# EAGLE design Luminis_20210106 (EAGLE 9.3.2)
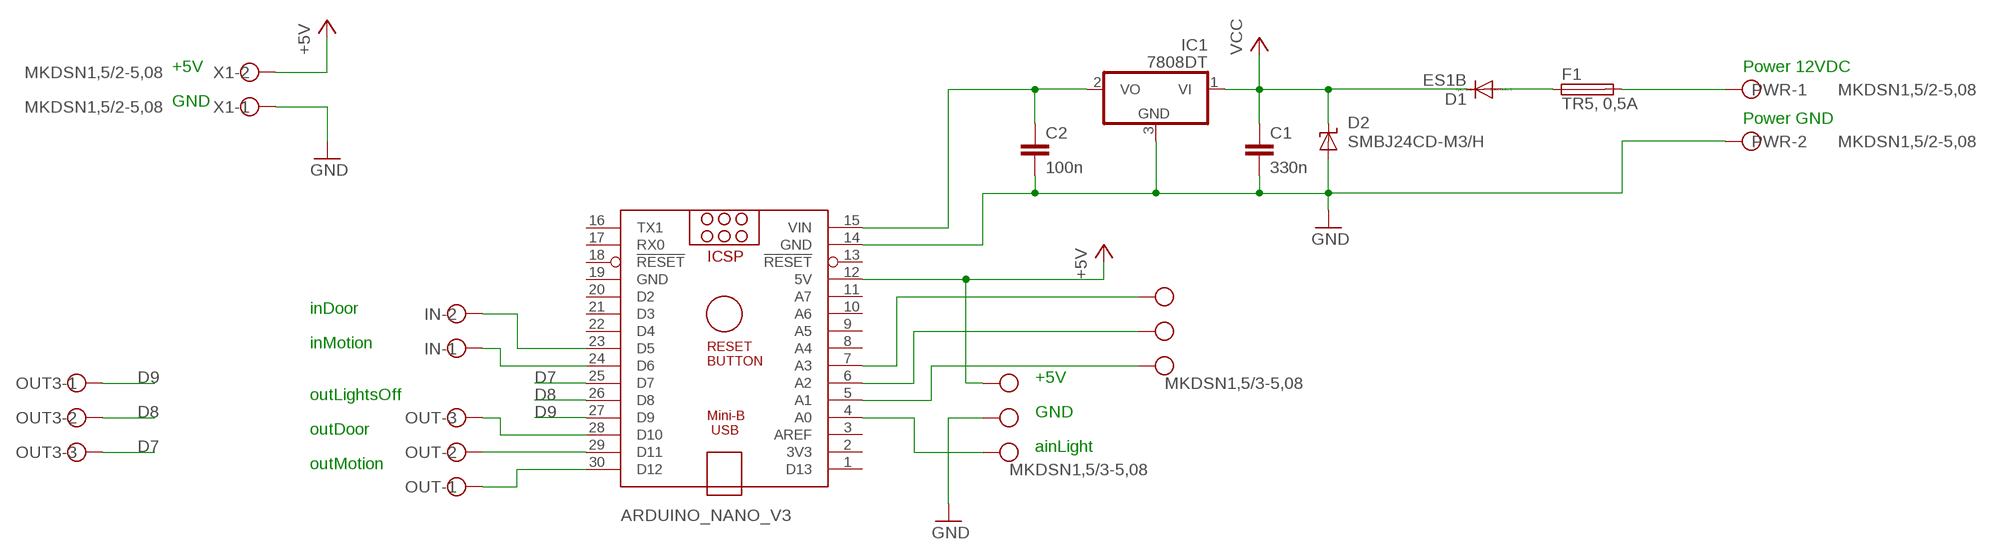
[diagram p0: schematic, sheet 1]

## Parts
ARDUINO_NANO_V3  ARDUINO_NANO  [ARDUINO_NANO]
C1  330n  C-EUC1206  [C1206]
C2  100n  C-EUC1206  [C1206]
D1  ES1B  DIODE-DO214AC  [DO214AC]
D2  SMBJ24CD-M3/H  SUPPRESSOR-SMBJ  [SMBJ]
F1  TR5, 0,5A  TR5  [TR5]
IC1  7808DT  [TO252]
IN  MKDSN1,5/2-5,08  [MKDSN1,5/2-5,08]
OUT  MKDSN1,5/3-5,08  [MKDSN1,5/3-5,08]
OUT1  MKDSN1,5/3-5,08  [MKDSN1,5/3-5,08]
OUT2  MKDSN1,5/3-5,08  [MKDSN1,5/3-5,08]
OUT3  MKDSN1,5/3-5,08  [MKDSN1,5/3-5,08]
PWR  MKDSN1,5/2-5,08  [MKDSN1,5/2-5,08]
X1  MKDSN1,5/2-5,08  [MKDSN1,5/2-5,08]

## Nets
+5V: ARDUINO_NANO_V3.12(5V) OUT1.1 X1.2
D7: ARDUINO_NANO_V3.25(D7) OUT3.3
D8: ARDUINO_NANO_V3.26(D8) OUT3.2
D9: ARDUINO_NANO_V3.27(D9) OUT3.1
GND: ARDUINO_NANO_V3.14(GND) C1.2 C2.2 D2.A IC1.3(GND) OUT1.2 PWR.2 X1.1
N$1: ARDUINO_NANO_V3.4(A0) OUT1.3
N$2: ARDUINO_NANO_V3.5(A1) OUT2.3
N$3: ARDUINO_NANO_V3.30(D12) OUT.1
N$4: ARDUINO_NANO_V3.6(A2) OUT2.2
N$5: F1.2 PWR.1
N$6: ARDUINO_NANO_V3.29(D11) OUT.2
N$7: ARDUINO_NANO_V3.28(D10) OUT.3
N$8: ARDUINO_NANO_V3.7(A3) OUT2.1
N$9: ARDUINO_NANO_V3.24(D6) IN.1
N$10: ARDUINO_NANO_V3.23(D5) IN.2
N$46: D1.A F1.1
N$48: ARDUINO_NANO_V3.15(VIN) C2.1 IC1.2(VO)
VCC: C1.1 D1.C D2.C IC1.1(VI)
Unconnected: ARDUINO_NANO_V3.1(D13) ARDUINO_NANO_V3.2(3V3) ARDUINO_NANO_V3.3(AREF) ARDUINO_NANO_V3.8(A4) ARDUINO_NANO_V3.9(A5) ARDUINO_NANO_V3.10(A6) ARDUINO_NANO_V3.11(A7) ARDUINO_NANO_V3.13(!RESET) ARDUINO_NANO_V3.16(TX1) ARDUINO_NANO_V3.17(RX0) ARDUINO_NANO_V3.18(!RESET) ARDUINO_NANO_V3.20(D2) ARDUINO_NANO_V3.21(D3) ARDUINO_NANO_V3.22(D4)

## Notes on the sheet
- +5V | Power 12VDC
- GND
- Power GND
- inDoor
- inMotion
- +5V
- outLightsOff
- GND
- outDoor
- ainLight
- outMotion

## Power pins joined to a net without a drawn wire
GND: ARDUINO_NANO_V3.19(GND)

## Library data of the parts
ARDUINO_NANO_V3 = ArduinoNanoV30:ARDUINO_NANO: Arduino Nano V3.0 Overview: The Arduino Nano is a small, complete, and breadboard-friendly board based on the ATmega328 (Arduino Nano 3.x) or ATmega168 (Arduino Nano 2.x). It has more or less the same functionality of the Arduino Duemilanove, but in a different package. It lacks only a DC power jack, and works with a Mini-B USB cable instead of a standard one. The Nano was designed and is being produced by Gravitech. Specifications: Microcontroller Atmel ATmega168 or ATmega328 Operating Voltage (logic level) 5 V Input Voltage (recommended) 7-12 V Input Voltage (limits) 6-20 V Digital I/O Pins 14 (of which 6 provide PWM output) Analog Input Pins 8 DC Current per I/O Pin 40 mA Flash Memory 16 KB (ATmega168) or 32 KB (ATmega328) of which 2 KB used by bootloader SRAM 1 KB (ATmega168) or 2 KB (ATmega328) EEPROM 512 bytes (ATmega168) or 1 KB (ATmega328) Clock Speed 16 MHz Dimensions 0.73" x 1.70" Length 45 mm Width 18 mm Weigth 5 g Power: The Arduino Nano can be powered via the Mini-B USB connection, 6-20V unregulated external power supply (pin 30), or 5V regulated external power supply (pin 27). The power source is automatically selected to the highest voltage source. Memory: The ATmega168 has 16 KB of flash memory for storing code (of which 2 KB is used for the bootloader); the ATmega328 has 32 KB, (also with 2 KB used for the bootloader). The ATmega168 has 1 KB of SRAM and 512 bytes of EEPROM (which can be read and written with the EEPROM library); the ATmega328 has 2 KB of SRAM and 1 KB of EEPROM. Input and Output: Each of the 14 digital pins on the Nano can be used as an input or output, using pinMode(), digitalWrite(), and digitalRead() functions. They operate at 5 volts. Each pin can provide or receive a maximum of 40 mA and has an internal pull-up resistor (disconnected by default) of 20-50 kOhms. In addition, some pins have specialized functions. Visit Arduino - ArduinoBoardNano <https://www.arduino.cc/en/Main/ArduinoBoardNano>
C1 C2 = rcl:C-EU: CAPACITOR, European symbol; SPICEPREFIX: C
D1 = diode:DIODE-: DIODE
D2 = diode:SUPPRESSOR-: Suppressor diode
F1 = fuse:TR5: FUSE Wickmann; OC_FARNELL: unknown; OC_NEWARK: unknown
IC1 = linear:78*: Positive VOLTAGE REGULATOR Source: http://cache.national.com/ds/LM/LM78L05.pdf http://www.fairchildsemi.com/ds/LM/LM7805.pdf
IN PWR X1 = con-phoenix-508:MKDSN1,5/2-5,08: MKDSN 1,5/ 2-5,08 Printklemme Nennstrom: 13,5 A Nennspannung: 250 V Rastermaß: 5,08 mm Polzahl: 2 Anschlussart: Schraubanschluss Montage: Löten Anschlussrichtung Leiter/Platine: 0 ° Artikelnummer: 1729128 Source: http://eshop.phoenixcontact.com .. 1729128.pdf
OUT OUT1-OUT3 = con-phoenix-508:MKDSN1,5/3-5,08: MKDSN 1,5/ 3-5,08 Printklemme Nennstrom: 13,5 A Nennspannung: 250 V Rastermaß: 5,08 mm Polzahl: 3 Anschlussart: Schraubanschluss Montage: Löten Anschlussrichtung Leiter/Platine: 0 ° Artikelnummer: 1729131 Source: http://eshop.phoenixcontact.com .. 1729131.pdf

## Board
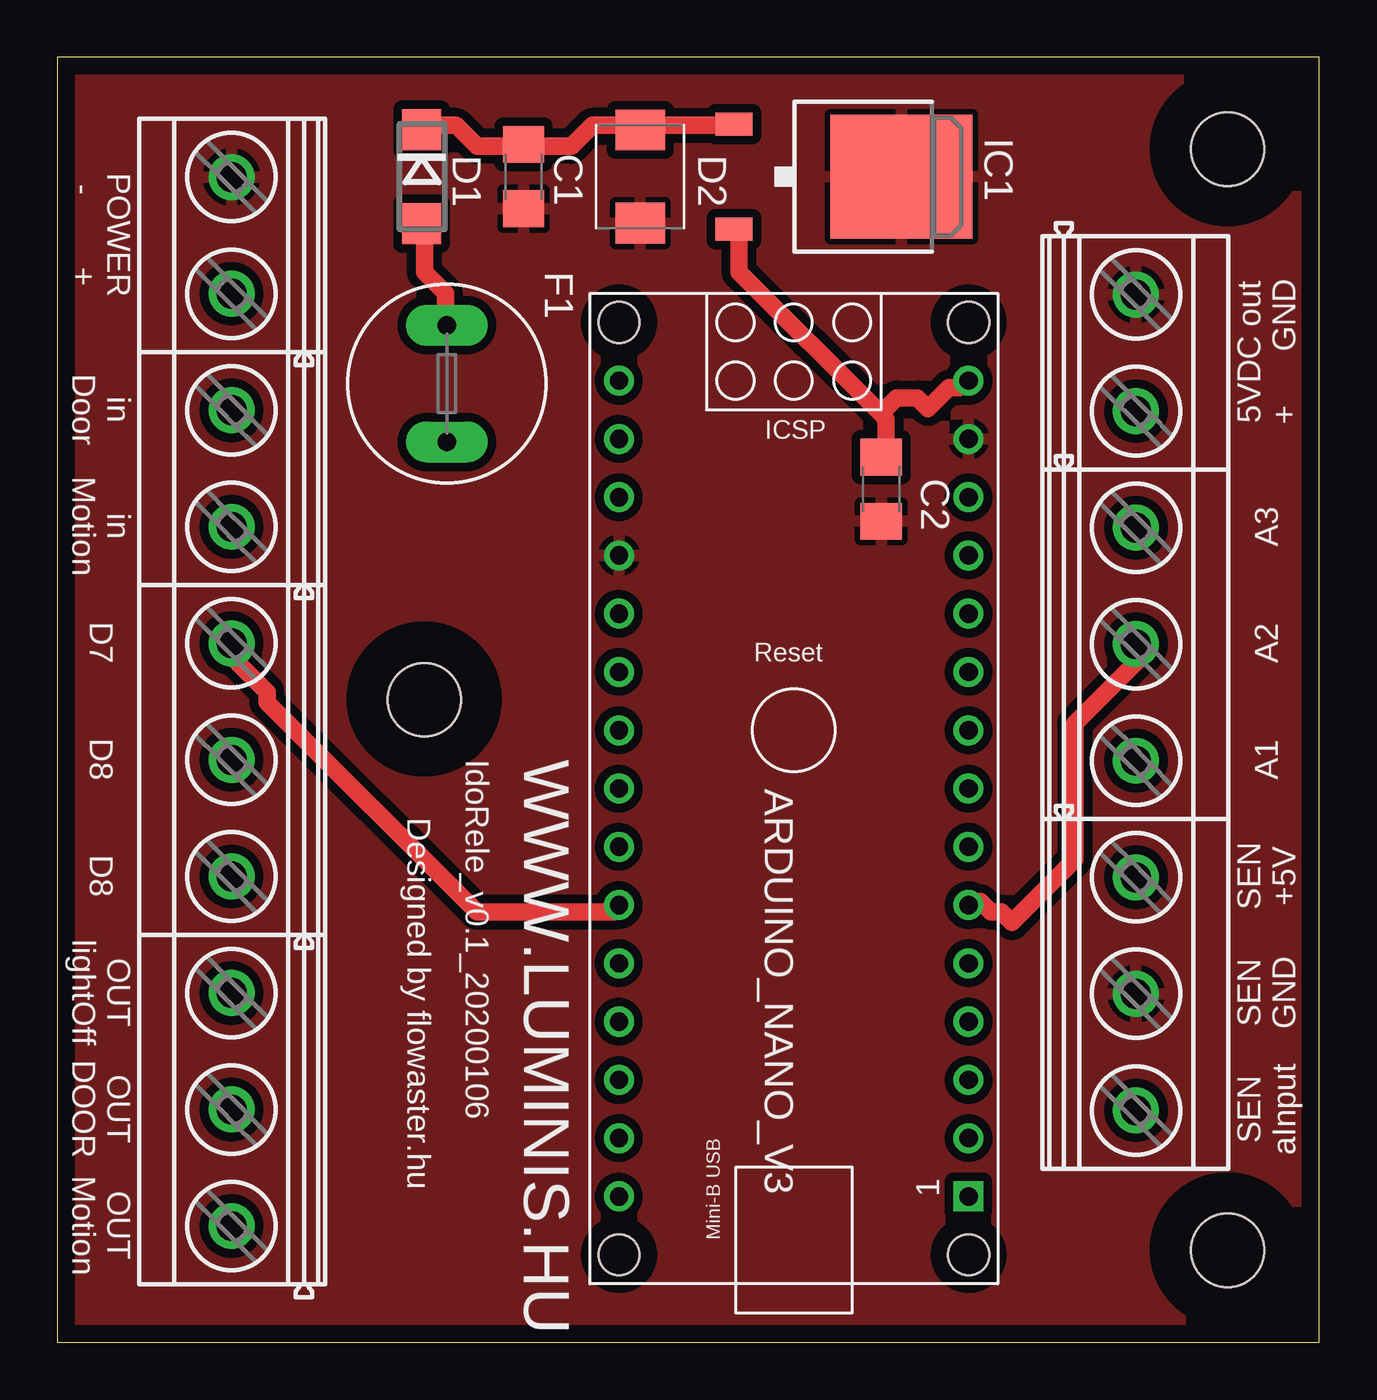
[diagram p1: board, top side]
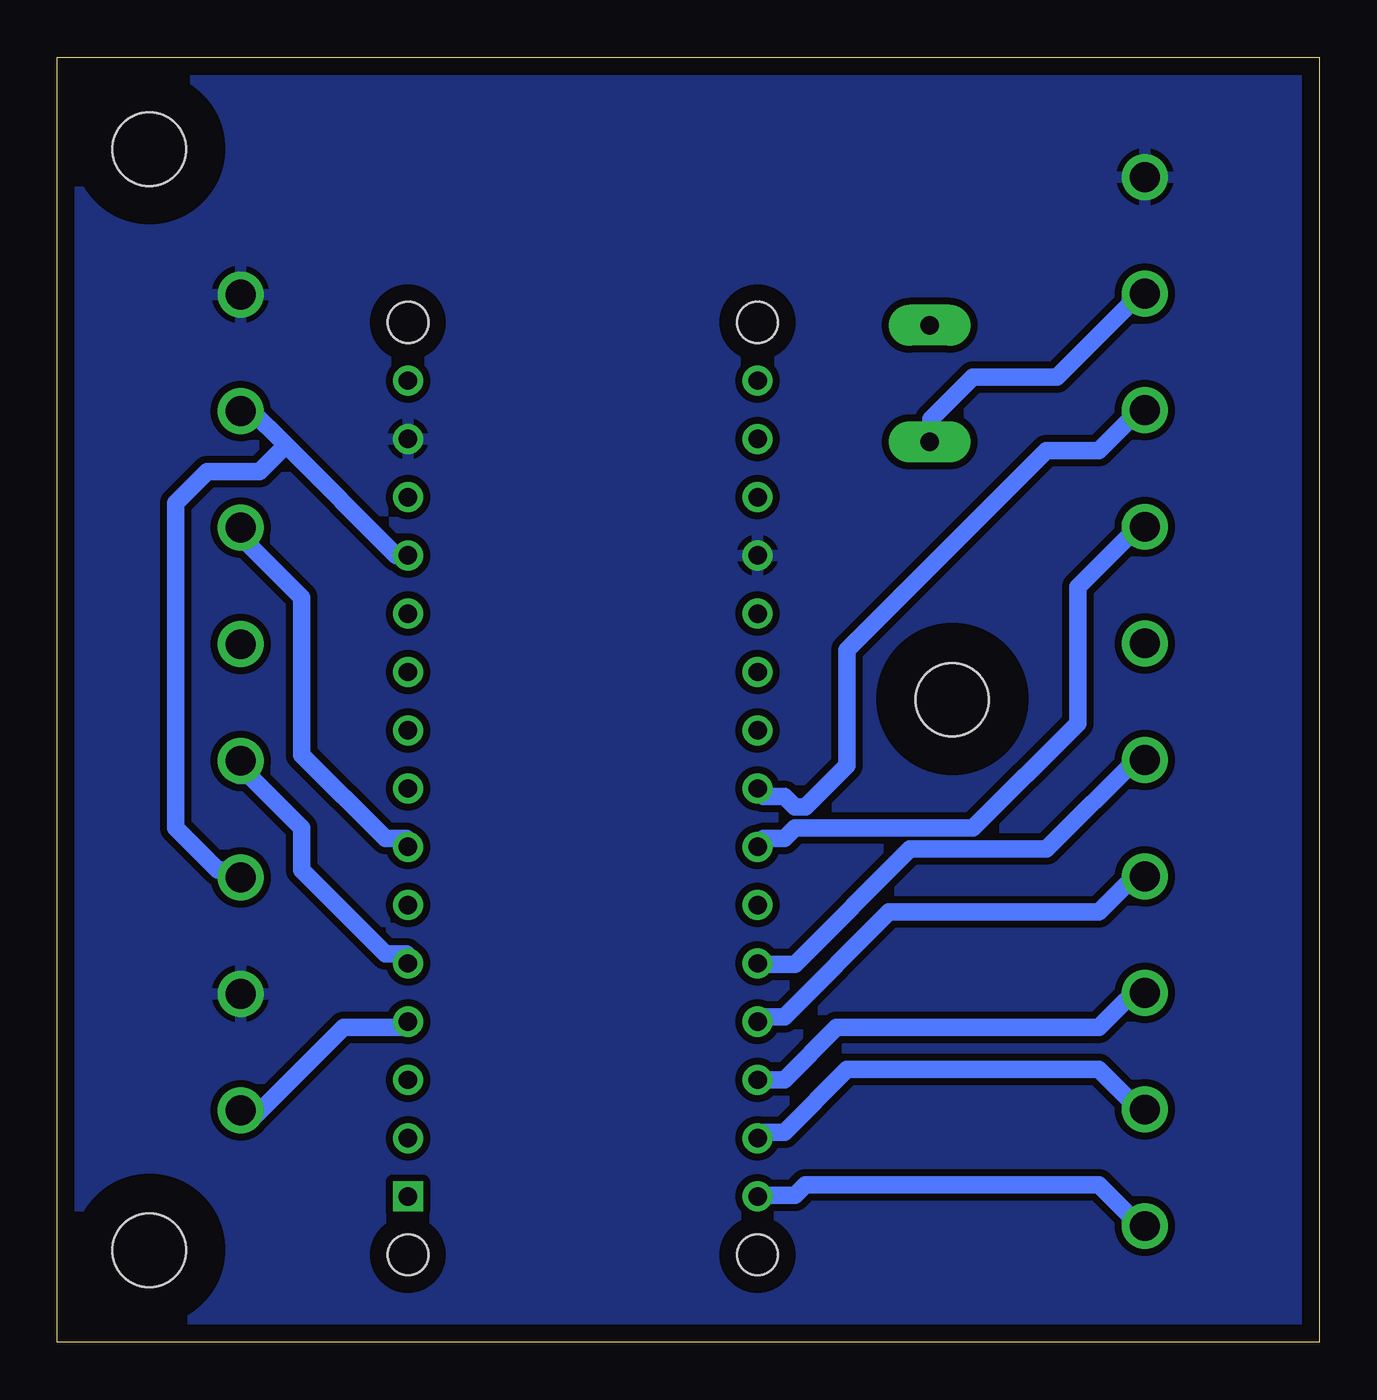
[diagram p2: board, bottom side, seen from below]

Size 55 x 56 mm. Coordinates in mm from the lower left corner, seen from the top.
Outline: 0,0 55,0 55,56 0,56 0,0
Copper layers (1*16): Top 0.035mm / dielectric 1.5mm / Bottom 0.035mm
Design rules "default *": minimum track width 30mil, minimum drill 0.35mm, track to track 6mil, track to pad 6mil, pad to pad 6mil, via to via 6mil, smd to smd 6mil, copper to edge 30mil, drill to drill 6mil, minimum pad ring 10mil, minimum via ring 8mil, stop-mask expansion 4mil, vias tented up to drill 0mil, thermal gap 10mil
Holes 3.2 mm at 51,52 51,4 16,28
tRestrict: area 48,49 to 54,55; area 48,1 to 54,7; area 13,25 to 19,31
bRestrict: area 48,49 to 54,55; area 48,1 to 54,7; area 13,25 to 19,31

### Footprints (pad centres in the part's own frame; a part is rotated, then mirrored left to right if it is on the bottom)
ARDUINO_NANO = drill 0.8 square: 1 -20.32,-7.62 | drill 0.8: 2 -17.78,-7.62; 3 -15.24,-7.62; 4 -12.7,-7.62; 5 -10.16,-7.62; 6 -7.62,-7.62; 7 -5.08,-7.62; 8 -2.54,-7.62; 9 0,-7.62; 10 2.54,-7.62; 11 5.08,-7.62; 12 7.62,-7.62; 13 10.16,-7.62; 14 12.7,-7.62; 15 15.24,-7.62; 16 15.24,7.62; 17 12.7,7.62; 18 10.16,7.62; 19 7.62,7.62; 20 5.08,7.62; 21 2.54,7.62; 22 0,7.62; 23 -2.54,7.62; 24 -5.08,7.62; 25 -7.62,7.62; 26 -10.16,7.62; 27 -12.7,7.62; 28 -15.24,7.62; 29 -17.78,7.62; 30 -20.32,7.62 | hole 1.778: -22.86,-7.62; -22.86,7.62; 17.78,7.62; 17.78,-7.62
C1206 = smd 1.6 x 1.8: 1 -1.4,0; 2 1.4,0
DO214AC = smd 1.8 x 1.7: A 2.05,0; C -2.05,0
SMBJ = smd 1.78 x 2.16: A 2.04,0; C -2.03,0
TR5 = drill 0.813 pad 1.778 long: 1 -2.54,0; 2 2.54,0
TO252 = smd 1 x 1.6: 1 -2.28,-4.8; 2 2.28,-4.8 | smd 5.4 x 6.2: 3 0,2.5
MKDSN1,5/2-5,08 = drill 1.3 pad 2: 1 -2.561,0.025; 2 2.519,0.025
MKDSN1,5/3-5,08 = drill 1.3 pad 2: 1 -7.641,0.025; 2 -2.561,0.025; 3 2.519,0.025

### Placement (x,y rotation side)
ARDUINO_NANO_V3  32.1,26.67 90 top
C1  20.32,50.8 270 top
C2  35.91,37.18 270 top
D1  15.88,50.8 270 top
D2  25.4,50.8 270 top
F1  16.98,41.78 270 top
IC1  34.29,50.8 270 top
IN  7.62,38.1 90 top
OUT  7.62,12.7 90 top
OUT1  46.99,12.62 270 top
OUT2  46.99,27.86 270 top
OUT3  7.62,27.94 90 top
PWR  7.62,48.26 90 top
X1  46.99,43.1 270 top

### Tracks (layer width: path | path; a pad name or v marks a point on that pad's centre or on a via)
+5V
  Bottom 0.762: ARDUINO_NANO_V3.12 40.23,34.29 45.03,39.09 | 45.03,39.09 46.63,40.69 X1.2 | 45.03,39.09 46.18,37.95 48.46,37.95 49.84,36.58 49.84,22.4 48.01,20.57 47.09,20.57 OUT1.1
D7
  Top 0.762: ARDUINO_NANO_V3.25 24.23,18.75 18.29,18.75 9.14,27.89 9.14,28.35 7.32,30.18 OUT3.3
D8
  Bottom 0.762: ARDUINO_NANO_V3.26 24.23,16.46 22.86,16.46 17.83,21.49 11.89,21.49 7.77,25.6 OUT3.2
D9
  Bottom 0.762: ARDUINO_NANO_V3.27 24.23,14.17 23.32,14.17 18.75,18.75 9.6,18.75 7.77,20.57 OUT3.1
GND
  pour Bottom (isolate 0.305): 0,56 55,56 55,0 0,0
  pour Top (isolate 0.381): 0,56 55,56 55,0 0,0
N$1
  Bottom 0.762: ARDUINO_NANO_V3.4 39.78,13.72 42.52,13.72 46.63,9.6 47.09,9.6 47.09,10.06 OUT1.3
N$2
  Bottom 0.762: ARDUINO_NANO_V3.5 39.78,16.92 40.69,16.92 44.35,20.57 44.35,22.4 46.63,24.69 47.09,24.69 47.55,25.15 47.09,25.6 OUT2.3
N$3
  Bottom 0.762: ARDUINO_NANO_V3.30 24.23,6.4 22.86,6.4 22.4,6.86 9.6,6.86 8.23,5.49 8.23,5.03 7.77,4.57 7.32,5.03 OUT.1
N$4
  Top 0.762: ARDUINO_NANO_V3.6 39.78,19.2 40.23,19.2 40.69,18.75 41.15,18.75 41.6,18.29 44.35,21.03 44.35,26.98 47.55,30.18 47.09,30.63 OUT2.2
N$5
  Bottom 0.762: F1.2 16.92,39.32 16.92,40.23 15.09,42.06 11.43,42.06 8.23,45.26 8.23,45.72 7.77,46.18 7.32,45.72 PWR.1
N$6
  Bottom 0.762: ARDUINO_NANO_V3.29 24.23,9.14 23.32,9.14 20.57,11.89 9.6,11.89 8.23,10.52 8.23,10.06 7.77,9.6 7.32,10.06 OUT.2
N$7
  Bottom 0.762: ARDUINO_NANO_V3.28 23.32,11.43 21.03,13.72 9.6,13.72 8.23,15.09 7.77,14.63 7.32,15.09 OUT.3
N$8
  Bottom 0.762: ARDUINO_NANO_V3.7 39.78,21.95 40.69,21.95 44.35,25.6 44.35,32.46 47.09,35.2 OUT2.1
N$9
  Bottom 0.762: ARDUINO_NANO_V3.24 24.23,21.95 23.32,21.95 22.86,22.4 15.09,22.4 10.52,26.98 10.52,32.92 8.23,35.2 8.23,35.66 7.77,36.12 7.32,35.66 IN.1
N$10
  Bottom 0.762: ARDUINO_NANO_V3.23 24.23,23.77 23.32,23.77 22.86,23.32 22.4,23.32 20.57,25.15 20.57,30.18 11.89,38.86 9.6,38.86 8.23,40.23 8.23,40.69 7.77,41.15 7.32,40.69 IN.2
N$46
  Top 0.762: D1.A 16,48.46 16,46.63 16.92,45.72 16.92,44.35 F1.1
N$48
  Top 0.762: 35.89,40.46 36.12,40.23 36.12,38.86 C2.1 | 35.89,40.46 29.72,46.63 29.72,48.46 IC1.2 | 35.89,40.46 36.58,41.15 37.49,41.15 37.95,40.69 38.86,41.6 39.32,41.6 ARDUINO_NANO_V3.15
VCC
  Top 0.762: IC1.1 29.26,53.03 25.6,53.03 D2.C 25.15,53.03 23.32,53.03 22.4,52.12 20.57,52.12 C1.1 20.12,52.12 18.29,52.12 17.37,53.03 16,53.03 D1.C

### Text on the board
tPlace: POWER / - + | 5VDC out / + GND | in / Door | in / Motion | A3 | D7 | A2 | D8 | IdoRele_v0.1_20200106 | WWW.LUMINIS.HU | A1 | Designed by flowaster.hu | D8 | SEN / +5V | OUT / lightOff | SEN / GND | OUT / DOOR | SEN / aInput | OUT / Motion